# Altium project STM32F407ZXT6.PrjPcb
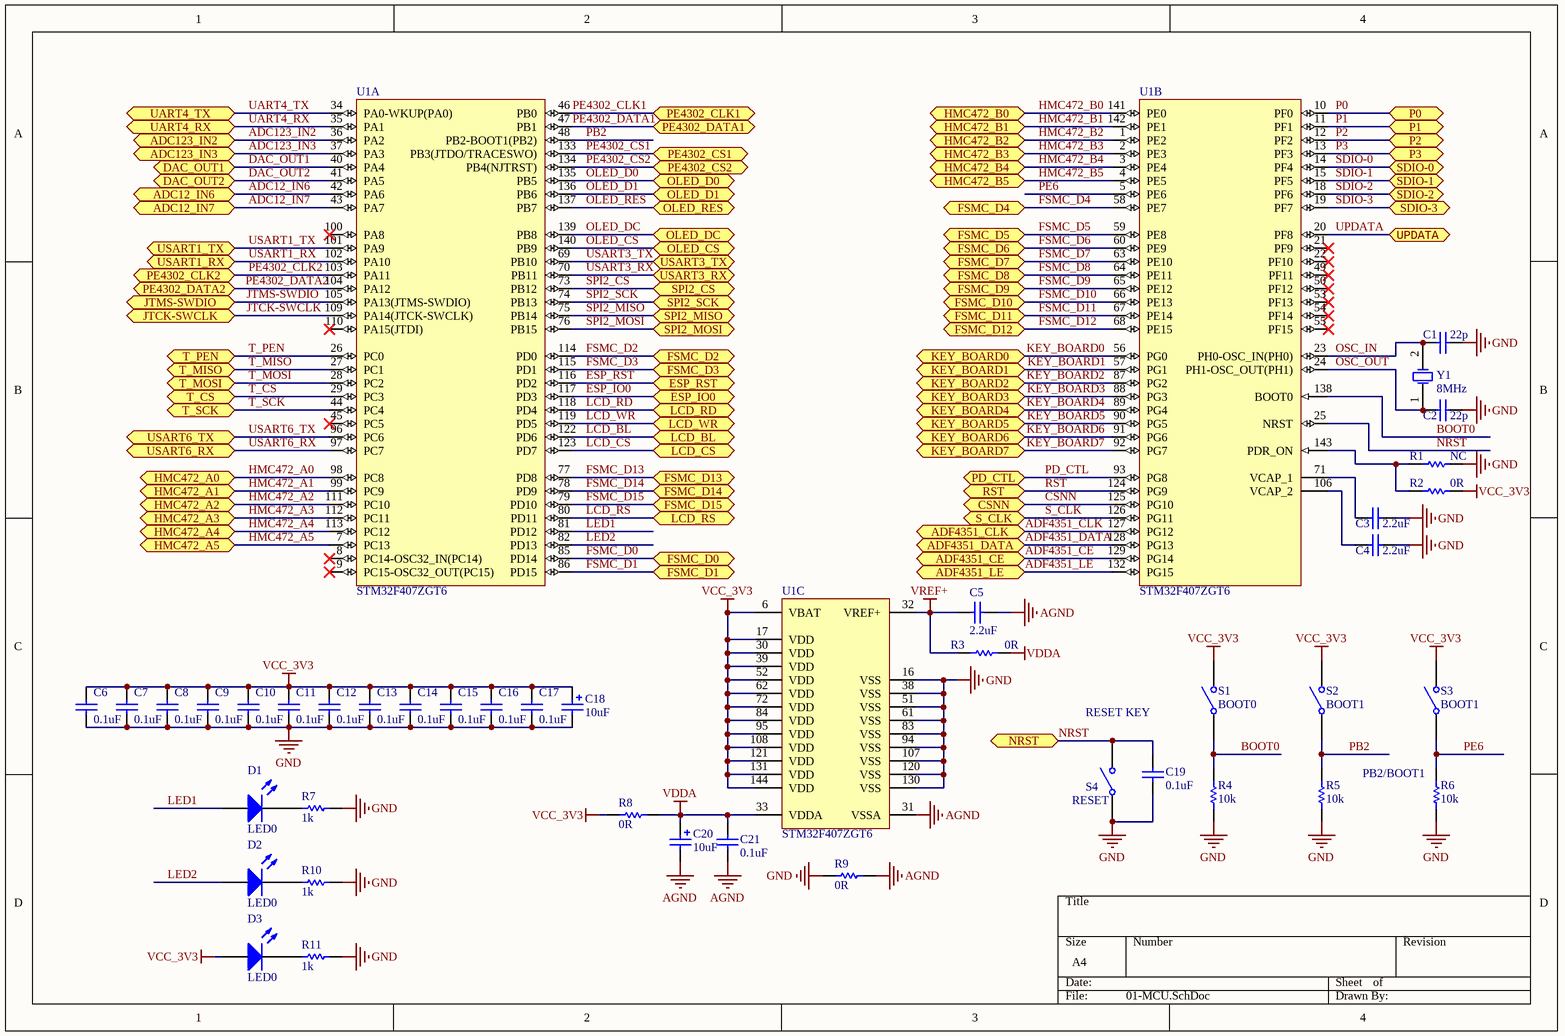
[diagram p0: 01-MCU.SchDoc]
4 sheets, 94 parts. Net scope: flat (ports and power ports of the same name join across sheets).
Board file: STM32F407ZXT6.PcbDoc
Sheets:
  01-MCU.SchDoc
  02-Interface.SchDoc
  03-Display.SchDoc
  04-POWER.SchDoc

## Sheet 01-MCU.SchDoc
size A4

### Parts
C1  22p  [0603C]
C2  22p  [0603C]
C3  2.2uF  [0603C]
C4  2.2uF  [0603C]
C5  2.2uF  [0603C]
C6  0.1uF  [0603C]
C7  0.1uF  [0603C]
C8  0.1uF  [0603C]
C9  0.1uF  [0603C]
C10  0.1uF  [0603C]
C11  0.1uF  [0603C]
C12  0.1uF  [0603C]
C13  0.1uF  [0603C]
C14  0.1uF  [0603C]
C15  0.1uF  [0603C]
C16  0.1uF  [0603C]
C17  0.1uF  [0603C]
C18  10uF  [1206T]
C19  0.1uF  [0603C]
C20  10uF  [1206T]
C21  0.1uF  [0603C]
D1  LED0  [0603D]
D2  LED0  [0603D]
D3  LED0  [0603D]
R1  NC  [0603R]
R2  0R  [0603R]
R3  0R  [0603R]
R4  10k  [0603R]
R5  10k  [0603R]
R6  10k  [0603R]
R7  1k  [0603R]
R8  0R  [0603R]
R9  0R  [0603R]
R10  1k  [0603R]
R11  1k  [0603R]
S1  BOOT0  [micro button_2_SMD]
S2  BOOT1  [micro button_2_SMD]
S3  BOOT1  [micro button_2_SMD]
S4  RESET  [micro button_2_SMD]
U1  STM32F407ZGT6  [QFP144-0r5-20X20]  (parts A,B,C of 3)
Y1  8MHz  [CO2-4R75X11R4-S]

### Ports
ADC12_IN6 (bidir), ADC12_IN7 (bidir), ADC123_IN2 (bidir), ADC123_IN3 (bidir), ADF4351_CE (bidir), ADF4351_CLK (bidir), ADF4351_DATA (bidir), ADF4351_LE (bidir), CSNN (bidir), DAC_OUT1 (bidir), DAC_OUT2 (bidir), ESP_IO0 (bidir), ESP_RST (bidir), FSMC_D0 (bidir), FSMC_D1 (bidir), FSMC_D2 (bidir), FSMC_D3 (bidir), FSMC_D4 (bidir), FSMC_D5 (bidir), FSMC_D6 (bidir), FSMC_D7 (bidir), FSMC_D8 (bidir), FSMC_D9 (bidir), FSMC_D10 (bidir), FSMC_D11 (bidir), FSMC_D12 (bidir), FSMC_D13 (bidir), FSMC_D14 (bidir), FSMC_D15 (bidir), HMC472_A0 (bidir), HMC472_A1 (bidir), HMC472_A2 (bidir), HMC472_A3 (bidir), HMC472_A4 (bidir), HMC472_A5 (bidir), HMC472_B0 (bidir), HMC472_B1 (bidir), HMC472_B2 (bidir), HMC472_B3 (bidir), HMC472_B4 (bidir), HMC472_B5 (bidir), JTCK-SWCLK (bidir), JTMS-SWDIO (bidir), KEY_BOARD0 (bidir), KEY_BOARD1 (bidir), KEY_BOARD2 (bidir), KEY_BOARD3 (bidir), KEY_BOARD4 (bidir), KEY_BOARD5 (bidir), KEY_BOARD6 (bidir), KEY_BOARD7 (bidir), LCD_BL (bidir), LCD_CS (bidir), LCD_RD (bidir), LCD_RS (bidir), LCD_WR (bidir), NRST (bidir), OLED_CS (bidir), OLED_D0 (bidir), OLED_D1 (bidir), OLED_DC (bidir), OLED_RES (bidir), P0 (bidir), P1 (bidir), P2 (bidir), P3 (bidir), PD_CTL (bidir), PE4302_CLK1 (bidir), PE4302_CLK2 (bidir), PE4302_CS1 (bidir), PE4302_CS2 (bidir), PE4302_DATA1 (bidir), PE4302_DATA2 (bidir), RST (bidir), S_CLK (bidir), SDIO-0 (bidir), SDIO-1 (bidir), SDIO-2 (bidir), SDIO-3 (bidir), SPI2_CS (bidir), SPI2_MISO (bidir), SPI2_MOSI (bidir), SPI2_SCK (bidir), T_CS (bidir), T_MISO (bidir), T_MOSI (bidir), T_PEN (bidir), T_SCK (bidir), UART4_RX (bidir), UART4_TX (bidir), UPDATA (bidir), USART1_RX (bidir), USART1_TX (bidir), USART3_RX (bidir), USART3_TX (bidir), USART6_RX (bidir), USART6_TX (bidir)

### Nets
AGND: C5.1 C20.2(-) C21.1 R9.1 U1.31(VSSA)
GND: C1.2 C2.2 C3.2 C4.2 C6.2 C7.2 C8.2 C9.2 C10.2 C11.2 C12.2 C13.2 C14.2 C15.2 C16.2 C17.2 C18.2(-) C19.1 R1.2 R4.1 R5.1 R6.1 R7.2 R9.2 R10.2 R11.2 S4.1(COMMON) U1.16(VSS) U1.38(VSS) U1.51(VSS) U1.61(VSS) U1.83(VSS) U1.94(VSS) U1.107(VSS) U1.120(VSS) U1.130(VSS)
VCC_3V3: C6.1 C7.1 C8.1 C9.1 C10.1 C11.1 C12.1 C13.1 C14.1 C15.1 C16.1 C17.1 C18.1(+) D3.1(A) R2.2 R8.2 S1.2(NO) S2.2(NO) S3.2(NO) U1.6(VBAT) U1.17(VDD) U1.30(VDD) U1.39(VDD) U1.52(VDD) U1.62(VDD) U1.72(VDD) U1.84(VDD) U1.95(VDD) U1.108(VDD) U1.121(VDD) U1.131(VDD) U1.144(VDD)
VDDA: C20.1(+) C21.2 R3.1 R8.1 U1.33(VDDA)
VREF+: C5.2 R3.2 U1.32(VREF+)
ADC12_IN6: U1.42(PA6) ; port ADC12_IN6
ADC12_IN7: U1.43(PA7) ; port ADC12_IN7
ADC123_IN2: U1.36(PA2) ; port ADC123_IN2
ADC123_IN3: U1.37(PA3) ; port ADC123_IN3
ADF4351_CE: U1.129(PG14) ; port ADF4351_CE
ADF4351_CLK: U1.127(PG12) ; port ADF4351_CLK
ADF4351_DATA: U1.128(PG13) ; port ADF4351_DATA
ADF4351_LE: U1.132(PG15) ; port ADF4351_LE
BOOT0: R4.2 S1.1(COMMON) U1.138(BOOT0)
CSNN: U1.125(PG10) ; port CSNN
DAC_OUT1: U1.40(PA4) ; port DAC_OUT1
DAC_OUT2: U1.41(PA5) ; port DAC_OUT2
ESP_IO0: U1.117(PD3) ; port ESP_IO0
ESP_RST: U1.116(PD2) ; port ESP_RST
FSMC_D0: U1.85(PD14) ; port FSMC_D0
FSMC_D1: U1.86(PD15) ; port FSMC_D1
FSMC_D2: U1.114(PD0) ; port FSMC_D2
FSMC_D3: U1.115(PD1) ; port FSMC_D3
FSMC_D4: U1.58(PE7) ; port FSMC_D4
FSMC_D5: U1.59(PE8) ; port FSMC_D5
FSMC_D6: U1.60(PE9) ; port FSMC_D6
FSMC_D7: U1.63(PE10) ; port FSMC_D7
FSMC_D8: U1.64(PE11) ; port FSMC_D8
FSMC_D9: U1.65(PE12) ; port FSMC_D9
FSMC_D10: U1.66(PE13) ; port FSMC_D10
FSMC_D11: U1.67(PE14) ; port FSMC_D11
FSMC_D12: U1.68(PE15) ; port FSMC_D12
FSMC_D13: U1.77(PD8) ; port FSMC_D13
FSMC_D14: U1.78(PD9) ; port FSMC_D14
FSMC_D15: U1.79(PD10) ; port FSMC_D15
HMC472_A0: U1.98(PC8) ; port HMC472_A0
HMC472_A1: U1.99(PC9) ; port HMC472_A1
HMC472_A2: U1.111(PC10) ; port HMC472_A2
HMC472_A3: U1.112(PC11) ; port HMC472_A3
HMC472_A4: U1.113(PC12) ; port HMC472_A4
HMC472_A5: U1.7(PC13) ; port HMC472_A5
HMC472_B0: U1.141(PE0) ; port HMC472_B0
HMC472_B1: U1.142(PE1) ; port HMC472_B1
HMC472_B2: U1.1(PE2) ; port HMC472_B2
HMC472_B3: U1.2(PE3) ; port HMC472_B3
HMC472_B4: U1.3(PE4) ; port HMC472_B4
HMC472_B5: U1.4(PE5) ; port HMC472_B5
JTCK-SWCLK: U1.109(PA14(JTCK-SWCLK)) ; port JTCK-SWCLK
JTMS-SWDIO: U1.105(PA13(JTMS-SWDIO)) ; port JTMS-SWDIO
KEY_BOARD0: U1.56(PG0) ; port KEY_BOARD0
KEY_BOARD1: U1.57(PG1) ; port KEY_BOARD1
KEY_BOARD2: U1.87(PG2) ; port KEY_BOARD2
KEY_BOARD3: U1.88(PG3) ; port KEY_BOARD3
KEY_BOARD4: U1.89(PG4) ; port KEY_BOARD4
KEY_BOARD5: U1.90(PG5) ; port KEY_BOARD5
KEY_BOARD6: U1.91(PG6) ; port KEY_BOARD6
KEY_BOARD7: U1.92(PG7) ; port KEY_BOARD7
LCD_BL: U1.122(PD6) ; port LCD_BL
LCD_CS: U1.123(PD7) ; port LCD_CS
LCD_RD: U1.118(PD4) ; port LCD_RD
LCD_RS: U1.80(PD11) ; port LCD_RS
LCD_WR: U1.119(PD5) ; port LCD_WR
LED1: D1.1(A) U1.81(PD12)
LED2: D2.1(A) U1.82(PD13)
NRST: C19.2 S4.2(NO) U1.25(NRST) ; port NRST
OLED_CS: U1.140(PB9) ; port OLED_CS
OLED_D0: U1.135(PB5) ; port OLED_D0
OLED_D1: U1.136(PB6) ; port OLED_D1
OLED_DC: U1.139(PB8) ; port OLED_DC
OLED_RES: U1.137(PB7) ; port OLED_RES
OSC_IN: C1.1 U1.23(PH0-OSC_IN(PH0)) Y1.2(OSC2)
OSC_OUT: C2.1 U1.24(PH1-OSC_OUT(PH1)) Y1.1(OSC1)
P0: U1.10(PF0) ; port P0
P1: U1.11(PF1) ; port P1
P2: U1.12(PF2) ; port P2
P3: U1.13(PF3) ; port P3
PB2: R5.2 S2.1(COMMON) U1.48(PB2-BOOT1(PB2))
PD_CTL: U1.93(PG8) ; port PD_CTL
PE6: R6.2 S3.1(COMMON) U1.5(PE6)
PE4302_CLK1: U1.46(PB0) ; port PE4302_CLK1
PE4302_CLK2: U1.103(PA11) ; port PE4302_CLK2
PE4302_CS1: U1.133(PB3(JTDO/TRACESWO)) ; port PE4302_CS1
PE4302_CS2: U1.134(PB4(NJTRST)) ; port PE4302_CS2
PE4302_DATA1: U1.47(PB1) ; port PE4302_DATA1
PE4302_DATA2: U1.104(PA12) ; port PE4302_DATA2
RST: U1.124(PG9) ; port RST
S_CLK: U1.126(PG11) ; port S_CLK
SDIO-0: U1.14(PF4) ; port SDIO-0
SDIO-1: U1.15(PF5) ; port SDIO-1
SDIO-2: U1.18(PF6) ; port SDIO-2
SDIO-3: U1.19(PF7) ; port SDIO-3
SPI2_CS: U1.73(PB12) ; port SPI2_CS
SPI2_MISO: U1.75(PB14) ; port SPI2_MISO
SPI2_MOSI: U1.76(PB15) ; port SPI2_MOSI
SPI2_SCK: U1.74(PB13) ; port SPI2_SCK
T_CS: U1.29(PC3) ; port T_CS
T_MISO: U1.27(PC1) ; port T_MISO
T_MOSI: U1.28(PC2) ; port T_MOSI
T_PEN: U1.26(PC0) ; port T_PEN
T_SCK: U1.44(PC4) ; port T_SCK
UART4_RX: U1.35(PA1) ; port UART4_RX
UART4_TX: U1.34(PA0-WKUP(PA0)) ; port UART4_TX
UPDATA: U1.20(PF8) ; port UPDATA
USART1_RX: U1.102(PA10) ; port USART1_RX
USART1_TX: U1.101(PA9) ; port USART1_TX
USART3_RX: U1.70(PB11) ; port USART3_RX
USART3_TX: U1.69(PB10) ; port USART3_TX
USART6_RX: U1.97(PC7) ; port USART6_RX
USART6_TX: U1.96(PC6) ; port USART6_TX
NetC3_1: C3.1 U1.71(VCAP_1)
NetC4_1: C4.1 U1.106(VCAP_2)
NetD1_2: D1.2(K) R7.1
NetD2_2: D2.2(K) R10.1
NetD3_2: D3.2(K) R11.1
NetR1_1: R1.1 R2.1 U1.143(PDR_ON)

Not connected (* = marked no-connect by the designer): U1 8(PC14-OSC32_IN(PC14))* 9(PC15-OSC32_OUT(PC15))* 21(PF9)* 22(PF10)* 45(PC5)* 49(PF11)* 50(PF12)* 53(PF13)* 54(PF14)* 55(PF15)* 100(PA8)* 110(PA15(JTDI))*

### Notes on the sheet
- RESET KEY
- (near R6) PB2/BOOT1

### Library data of the parts
C1-C17 C19 C21 = Cap1: CAP CER 10000PF 100V X7R 0603; Manufacturer: TDK Corporation; Manufacturer Part Number: C1608X7R2A103K080AA; Tolerance: ±10%; Notification: Current market demand for these product types have resulted in fluctuating and extending lead times. Lead times may differ.; Supplier 1: Digi-Key; RoHS: RoHS Compliant; Category: Capacitors; Stock 1: 40000; Pricing 1: 4000=0.01438 (USD); Packaging: Tape & Reel (TR); Part Status: Active; Voltage - Rated: 100V; Temperature Coefficient: X7R; Operating Temperature: -55°C ~ 125°C; Features: -; Ratings: -; Applications: General Purpose; Failure Rate: -; Mounting Type: Surface Mount, MLCC; Package / Case: 0603 (1608 Metric); Size / Dimension: 0.063" L x 0.032" W (1.60mm x 0.80mm); Height - Seated (Max): -; Thickness (Max): 0.035" (0.90mm); Lead Spacing: -; Lead Style: -; ComponentLink1URL: https://product.tdk.com/info/en/catalog/datasheets/mlcc_commercial_midvoltage_en.pdf; ComponentLink1Description: https://product.tdk.com/info/en/catalog/datasheets/mlcc_commercial_midvoltage_en.pdf; Supplier Part Number 1: 445-1304-2-ND
  C1 C2: Value: 22p
  C3-C5: Value: 2.2uF
  C6-C17 C19 C21: Value: 0.1uF
C18 C20 = Cap2: CAP TANT 10UF 10V 10% 1206; Manufacturer: KEMET; Manufacturer Part Number: T491A106K010AT7280; Manufacturer Size Code: A; Type: Molded; ESR (Equivalent Series Resistance): 3.8 Ohm; Lifetime @ Temp.: 2000 Hrs @ 125°C; Notification: Current market demand for these product types have resulted in fluctuating and extending lead times. Lead times may differ.; Supplier 1: Digi-Key; RoHS: RoHS Compliant; Category: Capacitors; Stock 1: 27000; Pricing 1: 9000=0.084, 18000=0.08138, 27000=0.07875, 63000=0.0735 (USD); Packaging: Tape & Reel (TR); Part Status: Active; Tolerance: ±10%; Operating Temperature: -55°C ~ 125°C; Mounting Type: Surface Mount; Package / Case: 1206 (3216 Metric); Size / Dimension: 0.126" L x 0.063" W (3.20mm x 1.60mm); Height - Seated (Max): 0.071" (1.80mm); Lead Spacing: -; Features: General Purpose; Failure Rate: -; ComponentLink1URL: https://api.kemet.com/component-edge/download/datasheet/T491A106K010AT7280.pdf; ComponentLink1Description: https://api.kemet.com/component-edge/download/datasheet/T491A106K010AT7280.pdf; Supplier Part Number 1: 399-8268-2-ND; Value: 10uF
D1-D3 = LED0: Typical INFRARED GaAs LED; pin to pad: 1>2 2>1; Published: 8-Jun-2000; LatestRevisionDate: 08-Jul-2005; LatestRevisionNote: Mech Layer 1 removed.; PackageReference: LED-0; Publisher: Altium Limited; PackageDescription: LED; 2 Leads
R1-R11 = Res1: RES SMD 1K OHM 0.5% 1/16W 0603; Manufacturer: Susumu; Manufacturer Part Number: RR0816P-102-D; Power (Watts): 0.063W, 1/16W; Temperature Coefficient: ±25ppm/°C; Supplier 1: Digi-Key; RoHS: RoHS Compliant; Category: Resistors; Stock 1: 1648842; Pricing 1: 1=0.13, 10=0.122, 100=0.0483, 1000=0.0225, 2500=0.01973 (USD); Packaging: Digi-Reel?; Part Status: Active; Tolerance: ±0.5%; Composition: Thin Film; Features: -; Operating Temperature: -55°C ~ 125°C; Package / Case: 0603 (1608 Metric); Supplier Device Package: -; Size / Dimension: 0.063" L x 0.032" W (1.60mm x 0.80mm); Height - Seated (Max): 0.020" (0.50mm); Failure Rate: -; ComponentLink1URL: http://www.susumu.co.jp/common/pdf/n_catalog_partition05_en.pdf; ComponentLink1Description: http://www.susumu.co.jp/common/pdf/n_catalog_partition05_en.pdf; Supplier Part Number 1: RR08P1.0KDDKR-ND
  R1: Value: NC
  R2 R3 R8 R9: Value: 0R
  R4-R6: Value: 10k
  R7 R10 R11: Value: 1k
S1-S4 = SW-SPST: Single-Pole, Single-Throw Switch; Published: 24-Mar-1999; LatestRevisionDate: 17-Jul-2002; LatestRevisionNote: Re-released for DXP Platform.; PackageReference: SPST-2; Publisher: Altium Limited; PackageDescription: Switch; 2 Leads
U1 = STM32F407ZGT6: ARM Cortex-M4 32-bit MCU+FPU, 210 DMIPS, 1024 kB Flash, 192 kB Internal RAM, 114 I/Os, 144-pin LQFP, -40 to 85 degC, Tray; Manufacturer: STMicroelectronics; D/A Converter: 2x12-bit; FLASH Size (Prog) (kB): 1024; I/Os (High Current): 114; Internal RAM Size (kB): 192; Operating Frequency(F) (Processor speed) (MHz): 168; Supply Voltage(Vcc) max (V): 3.6; Supply Voltage(Vcc) min (V): 1.8; DatasheetVersion: Rev. 4; PackageVersion: Rev. 4, 06/2013; PackageReference: LQFP144; PackageDescription: 144-Pin Low Profile Quad Flat Package, 20 x 20 mm Body, 0.5 mm Pitch; Supplier 1: Digi-Key; Supplier Part Number 1: 497-11766-ND; Supplier 2: Newark; Supplier Part Number 2: 73T2334; Supplier 3: Mouser; Supplier Part Number 3: 511-STM32F407ZGT6; Core: ARM Cortex-M4; Packing: Tray; Mounting Technology: Surface Mount; PartNumber: STM32F407ZGT6; ComponentLink1Description: Manufacturer URL; ComponentLink1URL: http://www.st.com/web/en/home.html; ComponentLink2Description: Datasheet; ComponentLink2URL: http://www.st.com/st-web-ui/static/active/en/resource/technical/document/datasheet/DM00037051.pdf; ComponentLink3Description: Package Specification; ComponentLink3URL: http://www.st.com/st-web-ui/static/active/en/resource/technical/document/datasheet/DM00037051.pdf
Y1 = XTAL: Crystal Oscillator; Published: 8-Jun-2000; LatestRevisionDate: 17-Jul-2002; LatestRevisionNote: Re-released for DXP Platform.; PackageReference: R38; Publisher: Altium Limited; PackageDescription: Crystal, Thru-Hole; 2 Leads; Body 3.1 x 8.2 mm (Dia.xH)

## Sheet 02-Interface.SchDoc
size A4
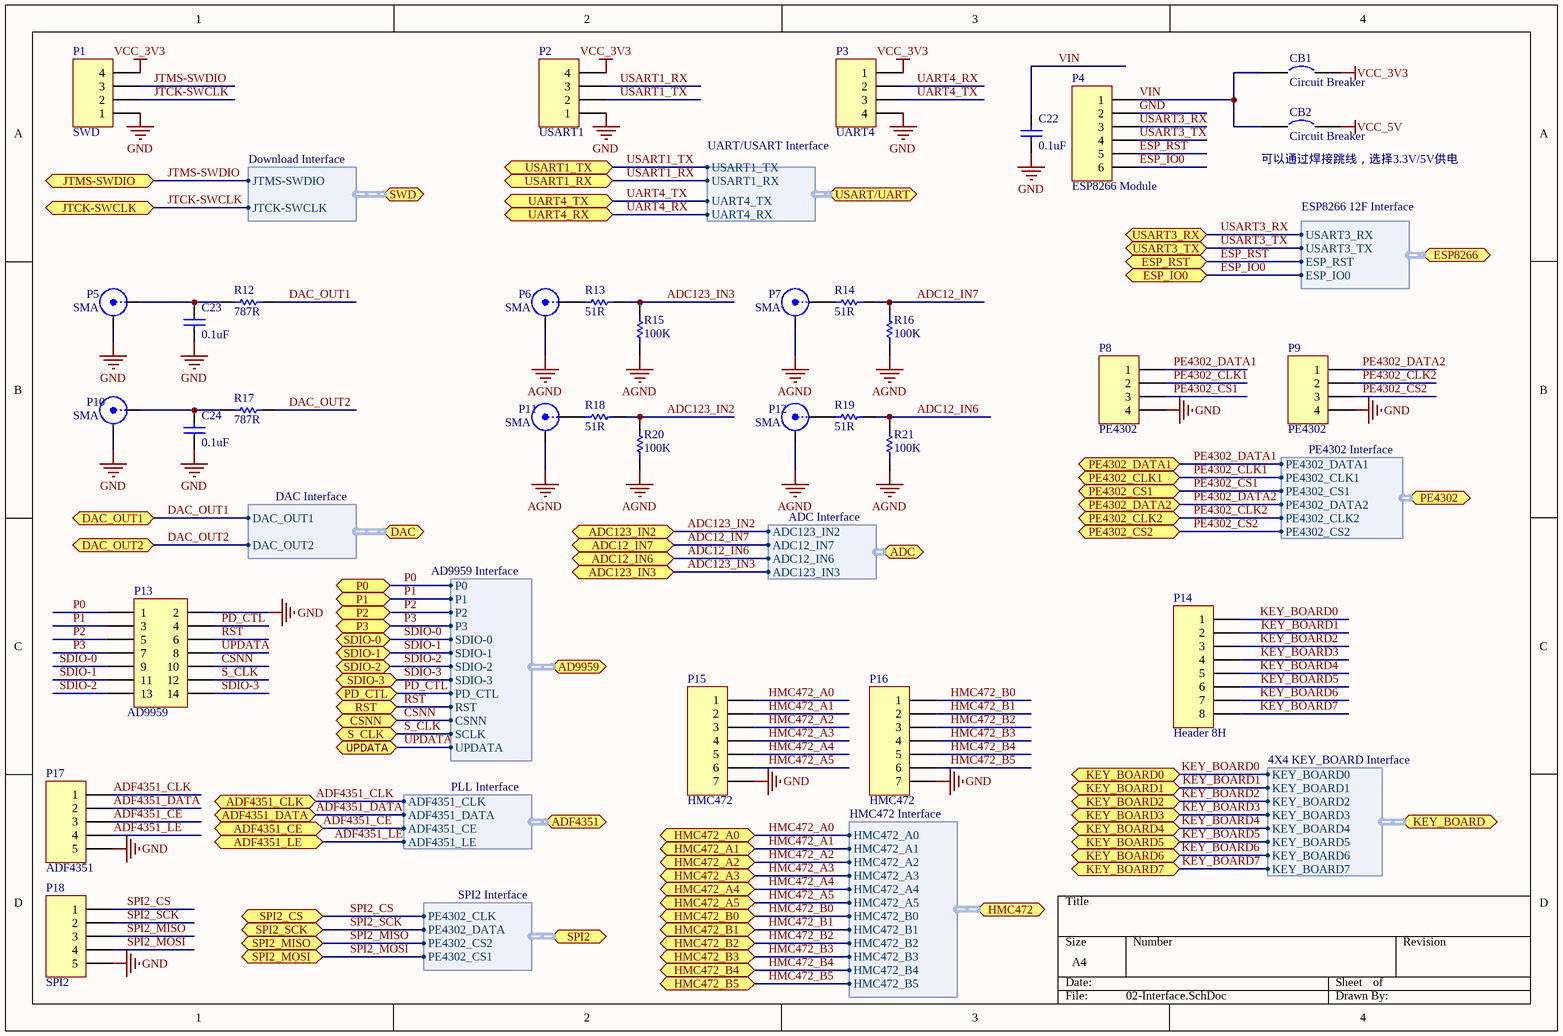
[diagram p1: 02-Interface.SchDoc]

### Parts
C22  0.1uF  [0603C]
C23  0.1uF  [0603C]
C24  0.1uF  [0603C]
CB1  Circuit Breaker  [CON20VP2R54-1X2TM]
CB2  Circuit Breaker  [CON20VP2R54-1X2TM]
P1  SWD  [1.25PWT-4P]
P2  USART1  [1.25PWT-4P]
P3  UART4  [XH_4]
P4  ESP8266 Module  [CON20VP2R54-1X6TM]
P5  SMA  [SMA-KE]
P6  SMA  [SMA-KE]
P7  SMA  [SMA-KE]
P8  PE4302  [XH_4]
P9  PE4302  [XH_4]
P10  SMA  [SMA-KE]
P11  SMA  [SMA-KE]
P12  SMA  [SMA-KE]
P13  AD9959  [CON20VP2R54-2X7TM-1]
P14  Header 8H  [XH_8]
P15  HMC472  [XH2.54-7P]
P16  HMC472  [XH2.54-7P]
P17  ADF4351  [XH_5]
P18  SPI2  [XH_5]
R12  787R  [0603R]
R13  51R  [0603R]
R14  51R  [0603R]
R15  100K  [0603R]
R16  100K  [0603R]
R17  787R  [0603R]
R18  51R  [0603R]
R19  51R  [0603R]
R20  100K  [0603R]
R21  100K  [0603R]

### Ports
AD9959 (bidir, harness AD9959 Interface), ADC12_IN6 (bidir), ADC12_IN7 (bidir), ADC123_IN2 (bidir), ADC123_IN3 (bidir), ADC (bidir, harness ADC Interface), ADF4351 (bidir, harness PLL Interface), ADF4351_CE (bidir), ADF4351_CLK (bidir), ADF4351_DATA (bidir), ADF4351_LE (bidir), CSNN (bidir), DAC (bidir, harness DAC Interface), DAC_OUT1 (bidir), DAC_OUT2 (bidir), ESP8266 (bidir, harness ESP8266 12F Interface), ESP_IO0 (bidir), ESP_RST (bidir), HMC472 (bidir, harness HMC472 Interface), HMC472_A0 (bidir), HMC472_A1 (bidir), HMC472_A2 (bidir), HMC472_A3 (bidir), HMC472_A4 (bidir), HMC472_A5 (bidir), HMC472_B0 (bidir), HMC472_B1 (bidir), HMC472_B2 (bidir), HMC472_B3 (bidir), HMC472_B4 (bidir), HMC472_B5 (bidir), JTCK-SWCLK (bidir), JTMS-SWDIO (bidir), KEY_BOARD0 (bidir), KEY_BOARD1 (bidir), KEY_BOARD2 (bidir), KEY_BOARD3 (bidir), KEY_BOARD4 (bidir), KEY_BOARD5 (bidir), KEY_BOARD6 (bidir), KEY_BOARD7 (bidir), KEY_BOARD (bidir, harness 4X4 KEY_BOARD Interface), P0 (bidir), P1 (bidir), P2 (bidir), P3 (bidir), PD_CTL (bidir), PE4302 (bidir, harness PE4302 Interface), PE4302_CLK1 (bidir), PE4302_CLK2 (bidir), PE4302_CS1 (bidir), PE4302_CS2 (bidir), PE4302_DATA1 (bidir), PE4302_DATA2 (bidir), RST (bidir), S_CLK (bidir), SDIO-0 (bidir), SDIO-1 (bidir), SDIO-2 (bidir), SDIO-3 (bidir), SPI2 (bidir, harness SPI2 Interface), SPI2_CS (bidir), SPI2_MISO (bidir), SPI2_MOSI (bidir), SPI2_SCK (bidir), SWD (bidir, harness Download Interface), UART4_RX (bidir), UART4_TX (bidir), UPDATA (bidir), USART1_RX (bidir), USART1_TX (bidir), USART3_RX (bidir), USART3_TX (bidir), USART/UART (bidir, harness UART/USART Interface)

### Harnesses
Download Interface: JTMS-SWDIO, JTCK-SWCLK
ESP8266 12F Interface: USART3_RX, USART3_TX, ESP_RST, ESP_IO0
UART/USART Interface: USART1_TX, USART1_RX, UART4_TX, UART4_RX
DAC Interface: DAC_OUT1, DAC_OUT2
SPI2 Interface: PE4302_CLK, PE4302_DATA, PE4302_CS2, PE4302_CS1
HMC472 Interface: HMC472_A0, HMC472_A1, HMC472_A2, HMC472_A3, HMC472_A4, HMC472_A5, HMC472_B0, HMC472_B1, HMC472_B2, HMC472_B3, HMC472_B4, HMC472_B5
4X4 KEY_BOARD Interface: KEY_BOARD0, KEY_BOARD1, KEY_BOARD2, KEY_BOARD3, KEY_BOARD4, KEY_BOARD5, KEY_BOARD6, KEY_BOARD7
ADC Interface: ADC123_IN2, ADC12_IN7, ADC12_IN6, ADC123_IN3
AD9959 Interface: P0, P1, P2, P3, SDIO-0, SDIO-1, SDIO-2, SDIO-3, PD_CTL, RST, CSNN, SCLK, UPDATA
PLL Interface: ADF4351_CLK, ADF4351_DATA, ADF4351_CE, ADF4351_LE
PE4302 Interface: PE4302_DATA1, PE4302_CLK1, PE4302_CS1, PE4302_DATA2, PE4302_CLK2, PE4302_CS2

### Nets
AGND: P6.2(Y) P7.2(Y) P11.2(Y) P12.2(Y) R15.2 R16.2 R20.2 R21.2
GND: C22.2 C23.2 C24.2 P1.1 P2.1 P3.4 P4.2 P5.2(Y) P8.4 P9.4 P10.2(Y) P13.2 P15.7 P16.7 P17.5 P18.5
VCC_3V3: CB1.2 P1.4 P2.4 P3.1
VCC_5V: CB2.2
ADC12_IN6: R19.1 R21.1 ; port ADC12_IN6, port ADC.ADC12_IN6
ADC12_IN7: R14.1 R16.1 ; port ADC12_IN7, port ADC.ADC12_IN7
ADC123_IN2: R18.1 R20.1 ; port ADC123_IN2, port ADC.ADC123_IN2
ADC123_IN3: R13.1 R15.1 ; port ADC123_IN3, port ADC.ADC123_IN3
ADF4351_CE: P17.3 ; port ADF4351_CE, port ADF4351.ADF4351_CE
ADF4351_CLK: P17.1 ; port ADF4351_CLK, port ADF4351.ADF4351_CLK
ADF4351_DATA: P17.2 ; port ADF4351_DATA, port ADF4351.ADF4351_DATA
ADF4351_LE: P17.4 ; port ADF4351_LE, port ADF4351.ADF4351_LE
CSNN: P13.10 ; port CSNN, port AD9959.CSNN
DAC_OUT1: R12.1 ; port DAC_OUT1, port DAC.DAC_OUT1
DAC_OUT2: R17.1 ; port DAC_OUT2, port DAC.DAC_OUT2
ESP_IO0: P4.6 ; port ESP_IO0, port ESP8266.ESP_IO0
ESP_RST: P4.5 ; port ESP_RST, port ESP8266.ESP_RST
HMC472_A0: P15.1 ; port HMC472_A0, port HMC472.HMC472_A0
HMC472_A1: P15.2 ; port HMC472_A1, port HMC472.HMC472_A1
HMC472_A2: P15.3 ; port HMC472_A2, port HMC472.HMC472_A2
HMC472_A3: P15.4 ; port HMC472_A3, port HMC472.HMC472_A3
HMC472_A4: P15.5 ; port HMC472_A4, port HMC472.HMC472_A4
HMC472_A5: P15.6 ; port HMC472_A5, port HMC472.HMC472_A5
HMC472_B0: P16.1 ; port HMC472_B0, port HMC472.HMC472_B0
HMC472_B1: P16.2 ; port HMC472_B1, port HMC472.HMC472_B1
HMC472_B2: P16.3 ; port HMC472_B2, port HMC472.HMC472_B2
HMC472_B3: P16.4 ; port HMC472_B3, port HMC472.HMC472_B3
HMC472_B4: P16.5 ; port HMC472_B4, port HMC472.HMC472_B4
HMC472_B5: P16.6 ; port HMC472_B5, port HMC472.HMC472_B5
JTCK-SWCLK: P1.2 ; port JTCK-SWCLK, port SWD.JTCK-SWCLK
JTMS-SWDIO: P1.3 ; port JTMS-SWDIO, port SWD.JTMS-SWDIO
KEY_BOARD0: P14.1 ; port KEY_BOARD0, port KEY_BOARD.KEY_BOARD0
KEY_BOARD1: P14.2 ; port KEY_BOARD1, port KEY_BOARD.KEY_BOARD1
KEY_BOARD2: P14.3 ; port KEY_BOARD2, port KEY_BOARD.KEY_BOARD2
KEY_BOARD3: P14.4 ; port KEY_BOARD3, port KEY_BOARD.KEY_BOARD3
KEY_BOARD4: P14.5 ; port KEY_BOARD4, port KEY_BOARD.KEY_BOARD4
KEY_BOARD5: P14.6 ; port KEY_BOARD5, port KEY_BOARD.KEY_BOARD5
KEY_BOARD6: P14.7 ; port KEY_BOARD6, port KEY_BOARD.KEY_BOARD6
KEY_BOARD7: P14.8 ; port KEY_BOARD7, port KEY_BOARD.KEY_BOARD7
P0: P13.1 ; port P0, port AD9959.P0
P1: P13.3 ; port P1, port AD9959.P1
P2: P13.5 ; port P2, port AD9959.P2
P3: P13.7 ; port P3, port AD9959.P3
PD_CTL: P13.4 ; port PD_CTL, port AD9959.PD_CTL
PE4302_CLK1: P8.2 ; port PE4302_CLK1, port PE4302.PE4302_CLK1
PE4302_CLK2: P9.2 ; port PE4302_CLK2, port PE4302.PE4302_CLK2
PE4302_CS1: P8.3 ; port PE4302_CS1, port PE4302.PE4302_CS1
PE4302_CS2: P9.3 ; port PE4302_CS2, port PE4302.PE4302_CS2
PE4302_DATA1: P8.1 ; port PE4302_DATA1, port PE4302.PE4302_DATA1
PE4302_DATA2: P9.1 ; port PE4302_DATA2, port PE4302.PE4302_DATA2
RST: P13.6 ; port RST, port AD9959.RST
S_CLK: P13.12 ; port S_CLK, port AD9959.SCLK
SDIO-0: P13.9 ; port SDIO-0, port AD9959.SDIO-0
SDIO-1: P13.11 ; port SDIO-1, port AD9959.SDIO-1
SDIO-2: P13.13 ; port SDIO-2, port AD9959.SDIO-2
SDIO-3: P13.14 ; port SDIO-3, port AD9959.SDIO-3
SPI2_CS: P18.1 ; port SPI2_CS, port SPI2.PE4302_CLK
SPI2_MISO: P18.3 ; port SPI2_MISO, port SPI2.PE4302_CS2
SPI2_MOSI: P18.4 ; port SPI2_MOSI, port SPI2.PE4302_CS1
SPI2_SCK: P18.2 ; port SPI2_SCK, port SPI2.PE4302_DATA
UART4_RX: P3.2 ; port UART4_RX, port USART/UART.UART4_RX
UART4_TX: P3.3 ; port UART4_TX, port USART/UART.UART4_TX
UPDATA: P13.8 ; port UPDATA, port AD9959.UPDATA
USART1_RX: P2.3 ; port USART1_RX, port USART/UART.USART1_RX
USART1_TX: P2.2 ; port USART1_TX, port USART/UART.USART1_TX
USART3_RX: P4.3 ; port USART3_RX, port ESP8266.USART3_RX
USART3_TX: P4.4 ; port USART3_TX, port ESP8266.USART3_TX
VIN: C22.1 CB1.1 CB2.1 P4.1
NetC23_1: C23.1 P5.1(X) R12.2
NetC24_1: C24.1 P10.1(X) R17.2
NetP6_1: P6.1(X) R13.2
NetP7_1: P7.1(X) R14.2
NetP11_1: P11.1(X) R18.2
NetP12_1: P12.1(X) R19.2

### Notes on the sheet
- (near CB2) 可以通过焊接跳线，选择3.3V/5V供电

### Library data of the parts
C22-C24 = Cap1: as C1 on sheet 01-MCU; Supplier 1: Digi-Key; RoHS: RoHS Compliant; Category: Capacitors; Stock 1: 40000; Pricing 1: 4000=0.01438 (USD); Packaging: Tape & Reel (TR); Part Status: Active; Voltage - Rated: 100V; Temperature Coefficient: X7R; Operating Temperature: -55°C ~ 125°C; Features: -; Ratings: -; Applications: General Purpose; Failure Rate: -; Mounting Type: Surface Mount, MLCC; Package / Case: 0603 (1608 Metric); Size / Dimension: 0.063" L x 0.032" W (1.60mm x 0.80mm); Height - Seated (Max): -; Thickness (Max): 0.035" (0.90mm); Lead Spacing: -; Lead Style: -; ComponentLink1URL: https://product.tdk.com/info/en/catalog/datasheets/mlcc_commercial_midvoltage_en.pdf; ComponentLink1Description: https://product.tdk.com/info/en/catalog/datasheets/mlcc_commercial_midvoltage_en.pdf; Supplier Part Number 1: 445-1304-2-ND; Value: 0.1uF
P1-P3 P8 P9 = Header 4: Header, 4-Pin; LatestRevisionDate: 17-Jul-2002; LatestRevisionNote: Re-released for DXP Platform.; Publisher: Altium Limited
P4 = Header 6: Header, 6-Pin; LatestRevisionDate: 17-Jul-2002; LatestRevisionNote: Re-released for DXP Platform.; Publisher: Altium Limited
P5-P7 P10-P12 = BNC: BNC Elbow Connector; LatestRevisionDate: 17-Jul-2002; LatestRevisionNote: Re-released for DXP Platform.; Publisher: Altium Limited
P13 = Header 7X2: Header, 7-Pin, Dual row; LatestRevisionDate: 17-Jul-2002; LatestRevisionNote: Re-released for DXP Platform.; Publisher: Altium Limited
P14 = Header 8H: Header, 8-Pin, Right Angle; LatestRevisionDate: 17-Jul-2002; LatestRevisionNote: Re-released for DXP Platform.; Publisher: Altium Limited
P15 P16 = Header 7: Header, 7-Pin; LatestRevisionDate: 17-Jul-2002; LatestRevisionNote: Re-released for DXP Platform.; Publisher: Altium Limited
P17 P18 = Header 5: Header, 5-Pin; LatestRevisionDate: 17-Jul-2002; LatestRevisionNote: Re-released for DXP Platform.; Publisher: Altium Limited
R12-R21 = Res1: as R1 on sheet 01-MCU; Supplier 1: Digi-Key; RoHS: RoHS Compliant; Category: Resistors; Stock 1: 1648842; Pricing 1: 1=0.13, 10=0.122, 100=0.0483, 1000=0.0225, 2500=0.01973 (USD); Packaging: Digi-Reel?; Part Status: Active; Tolerance: ±0.5%; Composition: Thin Film; Features: -; Operating Temperature: -55°C ~ 125°C; Package / Case: 0603 (1608 Metric); Supplier Device Package: -; Size / Dimension: 0.063" L x 0.032" W (1.60mm x 0.80mm); Height - Seated (Max): 0.020" (0.50mm); Failure Rate: -; ComponentLink1URL: http://www.susumu.co.jp/common/pdf/n_catalog_partition05_en.pdf; ComponentLink1Description: http://www.susumu.co.jp/common/pdf/n_catalog_partition05_en.pdf; Supplier Part Number 1: RR08P1.0KDDKR-ND
  R12 R17: Value: 787R
  R13 R14 R18 R19: Value: 51R
  R15 R16 R20 R21: Value: 100K
CB1 CB2 = Circuit Breaker: Published: 24-Mar-1999; LatestRevisionDate: 17-Jul-2002; LatestRevisionNote: Re-released for DXP Platform.; PackageReference: SPST-2; Publisher: Altium Limited; PackageDescription: Switch; 2 Leads

## Sheet 03-Display.SchDoc
size A4
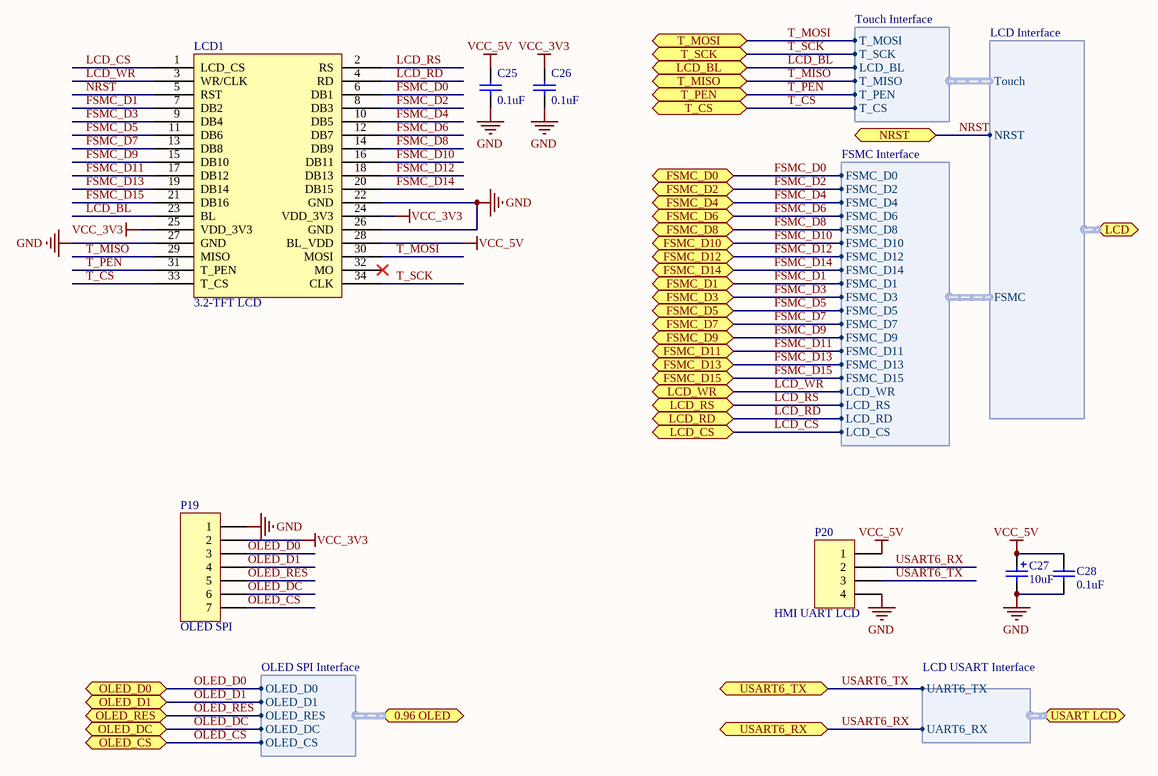
[diagram p2: 03-Display.SchDoc]

### Parts
C25  0.1uF  [0603C]
C26  0.1uF  [0603C]
C27  10uF  [1206T]
C28  0.1uF  [0603C]
LCD1  3.2-TFT LCD  [3.2_LCD]
P19  OLED SPI  [OLED_0.96_SPI]
P20  HMI UART LCD  [xh_4]

### Ports
0.96 OLED (bidir, harness OLED SPI Interface), FSMC_D0 (bidir), FSMC_D1 (bidir), FSMC_D2 (bidir), FSMC_D3 (bidir), FSMC_D4 (bidir), FSMC_D5 (bidir), FSMC_D6 (bidir), FSMC_D7 (bidir), FSMC_D8 (bidir), FSMC_D9 (bidir), FSMC_D10 (bidir), FSMC_D11 (bidir), FSMC_D12 (bidir), FSMC_D13 (bidir), FSMC_D14 (bidir), FSMC_D15 (bidir), LCD (bidir, harness LCD Interface), LCD_BL (bidir), LCD_CS (bidir), LCD_RD (bidir), LCD_RS (bidir), LCD_WR (bidir), NRST (bidir), OLED_CS (bidir), OLED_D0 (bidir), OLED_D1 (bidir), OLED_DC (bidir), OLED_RES (bidir), T_CS (bidir), T_MISO (bidir), T_MOSI (bidir), T_PEN (bidir), T_SCK (bidir), USART6_RX (bidir), USART6_TX (bidir), USART LCD (bidir, harness LCD USART Interface)

### Harnesses
LCD Interface: NRST, Touch, FSMC
Touch Interface: T_MOSI, T_SCK, LCD_BL, T_MISO, T_PEN, T_CS
FSMC Interface: FSMC_D0, FSMC_D2, FSMC_D4, FSMC_D6, FSMC_D8, FSMC_D10, FSMC_D12, FSMC_D14, FSMC_D1, FSMC_D3, FSMC_D5, FSMC_D7, FSMC_D9, FSMC_D11, FSMC_D13, FSMC_D15, LCD_WR, LCD_RS, LCD_RD, LCD_CS
OLED SPI Interface: OLED_D0, OLED_D1, OLED_RES, OLED_DC, OLED_CS
LCD USART Interface: UART6_TX, UART6_RX

### Nets
GND: C25.2 C26.2 C27.2(-) C28.1 LCD1.22(GND) LCD1.26(GND) LCD1.27(GND) P19.1 P20.4
VCC_3V3: C26.1 LCD1.24(VDD_3V3) LCD1.25(VDD_3V3) P19.2
VCC_5V: C25.1 C27.1(+) C28.2 LCD1.28(BL_VDD) P20.1
FSMC_D0: LCD1.6(DB1) ; port FSMC_D0, harness FSMC Interface.FSMC_D0
FSMC_D1: LCD1.7(DB2) ; port FSMC_D1, harness FSMC Interface.FSMC_D1
FSMC_D2: LCD1.8(DB3) ; port FSMC_D2, harness FSMC Interface.FSMC_D2
FSMC_D3: LCD1.9(DB4) ; port FSMC_D3, harness FSMC Interface.FSMC_D3
FSMC_D4: LCD1.10(DB5) ; port FSMC_D4, harness FSMC Interface.FSMC_D4
FSMC_D5: LCD1.11(DB6) ; port FSMC_D5, harness FSMC Interface.FSMC_D5
FSMC_D6: LCD1.12(DB7) ; port FSMC_D6, harness FSMC Interface.FSMC_D6
FSMC_D7: LCD1.13(DB8) ; port FSMC_D7, harness FSMC Interface.FSMC_D7
FSMC_D8: LCD1.14(DB9) ; port FSMC_D8, harness FSMC Interface.FSMC_D8
FSMC_D9: LCD1.15(DB10) ; port FSMC_D9, harness FSMC Interface.FSMC_D9
FSMC_D10: LCD1.16(DB11) ; port FSMC_D10, harness FSMC Interface.FSMC_D10
FSMC_D11: LCD1.17(DB12) ; port FSMC_D11, harness FSMC Interface.FSMC_D11
FSMC_D12: LCD1.18(DB13) ; port FSMC_D12, harness FSMC Interface.FSMC_D12
FSMC_D13: LCD1.19(DB14) ; port FSMC_D13, harness FSMC Interface.FSMC_D13
FSMC_D14: LCD1.20(DB15) ; port FSMC_D14, harness FSMC Interface.FSMC_D14
FSMC_D15: LCD1.21(DB16) ; port FSMC_D15, harness FSMC Interface.FSMC_D15
LCD_BL: LCD1.23(BL) ; port LCD_BL, harness Touch Interface.LCD_BL
LCD_CS: LCD1.1(LCD_CS) ; port LCD_CS, harness FSMC Interface.LCD_CS
LCD_RD: LCD1.4(RD) ; port LCD_RD, harness FSMC Interface.LCD_RD
LCD_RS: LCD1.2(RS) ; port LCD_RS, harness FSMC Interface.LCD_RS
LCD_WR: LCD1.3(WR/CLK) ; port LCD_WR, harness FSMC Interface.LCD_WR
NRST: LCD1.5(RST) ; port NRST, port LCD.NRST
OLED_CS: P19.7 ; port OLED_CS, port 0.96 OLED.OLED_CS
OLED_D0: P19.3 ; port OLED_D0, port 0.96 OLED.OLED_D0
OLED_D1: P19.4 ; port OLED_D1, port 0.96 OLED.OLED_D1
OLED_DC: P19.6 ; port OLED_DC, port 0.96 OLED.OLED_DC
OLED_RES: P19.5 ; port OLED_RES, port 0.96 OLED.OLED_RES
T_CS: LCD1.33(T_CS) ; port T_CS, harness Touch Interface.T_CS
T_MISO: LCD1.29(MISO) ; port T_MISO, harness Touch Interface.T_MISO
T_MOSI: LCD1.30(MOSI) ; port T_MOSI, harness Touch Interface.T_MOSI
T_PEN: LCD1.31(T_PEN) ; port T_PEN, harness Touch Interface.T_PEN
T_SCK: LCD1.34(CLK) ; port T_SCK, harness Touch Interface.T_SCK
USART6_RX: P20.2 ; port USART6_RX, port USART LCD.UART6_RX
USART6_TX: P20.3 ; port USART6_TX, port USART LCD.UART6_TX

Not connected (* = marked no-connect by the designer): LCD1 32(MO)*

### Library data of the parts
C25 C26 C28 = Cap1: as C1 on sheet 01-MCU; Supplier 1: Digi-Key; RoHS: RoHS Compliant; Category: Capacitors; Stock 1: 40000; Pricing 1: 4000=0.01438 (USD); Packaging: Tape & Reel (TR); Part Status: Active; Voltage - Rated: 100V; Temperature Coefficient: X7R; Operating Temperature: -55°C ~ 125°C; Features: -; Ratings: -; Applications: General Purpose; Failure Rate: -; Mounting Type: Surface Mount, MLCC; Package / Case: 0603 (1608 Metric); Size / Dimension: 0.063" L x 0.032" W (1.60mm x 0.80mm); Height - Seated (Max): -; Thickness (Max): 0.035" (0.90mm); Lead Spacing: -; Lead Style: -; ComponentLink1URL: https://product.tdk.com/info/en/catalog/datasheets/mlcc_commercial_midvoltage_en.pdf; ComponentLink1Description: https://product.tdk.com/info/en/catalog/datasheets/mlcc_commercial_midvoltage_en.pdf; Supplier Part Number 1: 445-1304-2-ND; Value: 0.1uF
C27 = Cap2: as C18 on sheet 01-MCU; Supplier 1: Digi-Key; RoHS: RoHS Compliant; Category: Capacitors; Stock 1: 27000; Pricing 1: 9000=0.084, 18000=0.08138, 27000=0.07875, 63000=0.0735 (USD); Packaging: Tape & Reel (TR); Part Status: Active; Tolerance: ±10%; Operating Temperature: -55°C ~ 125°C; Mounting Type: Surface Mount; Package / Case: 1206 (3216 Metric); Size / Dimension: 0.126" L x 0.063" W (3.20mm x 1.60mm); Height - Seated (Max): 0.071" (1.80mm); Lead Spacing: -; Features: General Purpose; Failure Rate: -; ComponentLink1URL: https://api.kemet.com/component-edge/download/datasheet/T491A106K010AT7280.pdf; ComponentLink1Description: https://api.kemet.com/component-edge/download/datasheet/T491A106K010AT7280.pdf; Supplier Part Number 1: 399-8268-2-ND; Value: 10uF
P19 = Header 7: Header, 7-Pin; LatestRevisionDate: 17-Jul-2002; LatestRevisionNote: Re-released for DXP Platform.; Publisher: Altium Limited
P20 = Header 4: Header, 4-Pin; LatestRevisionDate: 17-Jul-2002; LatestRevisionNote: Re-released for DXP Platform.; Publisher: Altium Limited

## Sheet 04-POWER.SchDoc
size A4
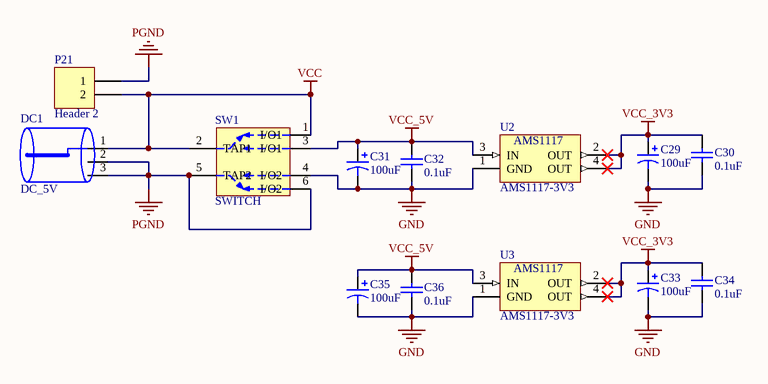
[diagram p3: 04-POWER.SchDoc]

### Parts
C29  100uF  [C_SMD(6.3x5.3)]
C30  0.1uF  [0603C]
C31  100uF  [C_SMD(6.3x5.3)]
C32  0.1uF  [0603C]
C33  100uF  [C_SMD(6.3x5.3)]
C34  0.1uF  [0603C]
C35  100uF  [C_SMD(6.3x5.3)]
C36  0.1uF  [0603C]
DC1  DC_5V  [DC_POWER]
P21  Header 2  [KF2EDG_3R81_2P]
SW1  SWITCH  [SW-8R5X8R5]
U2  AMS1117-3V3  [SOT223]
U3  AMS1117-3V3  [SOT223]

### Nets
GND: C29.2 C30.1 C31.2 C32.1 C33.2 C34.1 C35.2 C36.1 SW1.4(I/O2) U2.1(GND) U3.1(GND)
PGND: DC1.2(VCC) DC1.3(VCC) P21.1 SW1.5(TAP2) SW1.6(I/O2)
VCC: DC1.1(VCC) P21.2 SW1.1(I/O1) SW1.2(TAP1)
VCC_3V3: C29.1 C30.2 C33.1 C34.2 U2.2(OUT) U2.4(OUT) U3.2(OUT) U3.4(OUT)
VCC_5V: C31.1 C32.2 C35.1 C36.2 SW1.3(I/O1) U2.3(IN) U3.3(IN)

### Notes on the sheet
- (in symbol AMS1117-3v3) AMS1117

### Library data of the parts
C29 C31 C33 C35 = Cap Pol1: Polarized Capacitor (Radial); Published: 8-Jun-2000; LatestRevisionDate: 17-Jul-2002; LatestRevisionNote: Re-released for DXP Platform.; PackageReference: RB7.6-15; Publisher: Altium Limited; PackageDescription: Polarized Capacitor (Radial); 2 Leads; Value: 100uF
C30 C32 C34 C36 = Cap: Capacitor; Published: 8-Jun-2000; LatestRevisionDate: 17-Jul-2002; LatestRevisionNote: Re-released for DXP Platform.; PackageReference: RAD-0.3; Publisher: Altium Limited; PackageDescription: Radial Cap, Thru-Hole; 2 Leads; 0.3 in Pin Spacing; Value: 0.1uF
DC1 = DC_5V: DC005; Manufacturer: TruConnect; Manufacturer Part Number: K-DC-0052.5; Mount: Socket
P21 = Header 2: Header, 2-Pin; LatestRevisionDate: 17-Jul-2002; LatestRevisionNote: Re-released for DXP Platform.; Publisher: Altium Limited

## Nets that join several sheets
AGND: 01-MCU (5 pins), 02-Interface (8 pins)
GND: 01-MCU (36 pins), 02-Interface (16 pins), 03-Display (9 pins), 04-POWER (11 pins)
VCC_3V3: 01-MCU (32 pins), 02-Interface (CB1.2 P1.4 P2.4 P3.1), 03-Display (C26.1 LCD1.24 LCD1.25 P19.2), 04-POWER (8 pins)
VCC_5V: 02-Interface (CB2.2), 03-Display (5 pins), 04-POWER (7 pins)
ADC12_IN6: 01-MCU (U1.42), 02-Interface (R19.1 R21.1)
ADC12_IN7: 01-MCU (U1.43), 02-Interface (R14.1 R16.1)
ADC123_IN2: 01-MCU (U1.36), 02-Interface (R18.1 R20.1)
ADC123_IN3: 01-MCU (U1.37), 02-Interface (R13.1 R15.1)
ADF4351_CE: 01-MCU (U1.129), 02-Interface (P17.3)
ADF4351_CLK: 01-MCU (U1.127), 02-Interface (P17.1)
ADF4351_DATA: 01-MCU (U1.128), 02-Interface (P17.2)
ADF4351_LE: 01-MCU (U1.132), 02-Interface (P17.4)
CSNN: 01-MCU (U1.125), 02-Interface (P13.10)
DAC_OUT1: 01-MCU (U1.40), 02-Interface (R12.1)
DAC_OUT2: 01-MCU (U1.41), 02-Interface (R17.1)
ESP_IO0: 01-MCU (U1.117), 02-Interface (P4.6)
ESP_RST: 01-MCU (U1.116), 02-Interface (P4.5)
FSMC_D0: 01-MCU (U1.85), 03-Display (LCD1.6)
FSMC_D1: 01-MCU (U1.86), 03-Display (LCD1.7)
FSMC_D2: 01-MCU (U1.114), 03-Display (LCD1.8)
FSMC_D3: 01-MCU (U1.115), 03-Display (LCD1.9)
FSMC_D4: 01-MCU (U1.58), 03-Display (LCD1.10)
FSMC_D5: 01-MCU (U1.59), 03-Display (LCD1.11)
FSMC_D6: 01-MCU (U1.60), 03-Display (LCD1.12)
FSMC_D7: 01-MCU (U1.63), 03-Display (LCD1.13)
FSMC_D8: 01-MCU (U1.64), 03-Display (LCD1.14)
FSMC_D9: 01-MCU (U1.65), 03-Display (LCD1.15)
FSMC_D10: 01-MCU (U1.66), 03-Display (LCD1.16)
FSMC_D11: 01-MCU (U1.67), 03-Display (LCD1.17)
FSMC_D12: 01-MCU (U1.68), 03-Display (LCD1.18)
FSMC_D13: 01-MCU (U1.77), 03-Display (LCD1.19)
FSMC_D14: 01-MCU (U1.78), 03-Display (LCD1.20)
FSMC_D15: 01-MCU (U1.79), 03-Display (LCD1.21)
HMC472_A0: 01-MCU (U1.98), 02-Interface (P15.1)
HMC472_A1: 01-MCU (U1.99), 02-Interface (P15.2)
HMC472_A2: 01-MCU (U1.111), 02-Interface (P15.3)
HMC472_A3: 01-MCU (U1.112), 02-Interface (P15.4)
HMC472_A4: 01-MCU (U1.113), 02-Interface (P15.5)
HMC472_A5: 01-MCU (U1.7), 02-Interface (P15.6)
HMC472_B0: 01-MCU (U1.141), 02-Interface (P16.1)
HMC472_B1: 01-MCU (U1.142), 02-Interface (P16.2)
HMC472_B2: 01-MCU (U1.1), 02-Interface (P16.3)
HMC472_B3: 01-MCU (U1.2), 02-Interface (P16.4)
HMC472_B4: 01-MCU (U1.3), 02-Interface (P16.5)
HMC472_B5: 01-MCU (U1.4), 02-Interface (P16.6)
JTCK-SWCLK: 01-MCU (U1.109), 02-Interface (P1.2)
JTMS-SWDIO: 01-MCU (U1.105), 02-Interface (P1.3)
KEY_BOARD0: 01-MCU (U1.56), 02-Interface (P14.1)
KEY_BOARD1: 01-MCU (U1.57), 02-Interface (P14.2)
KEY_BOARD2: 01-MCU (U1.87), 02-Interface (P14.3)
KEY_BOARD3: 01-MCU (U1.88), 02-Interface (P14.4)
KEY_BOARD4: 01-MCU (U1.89), 02-Interface (P14.5)
KEY_BOARD5: 01-MCU (U1.90), 02-Interface (P14.6)
KEY_BOARD6: 01-MCU (U1.91), 02-Interface (P14.7)
KEY_BOARD7: 01-MCU (U1.92), 02-Interface (P14.8)
LCD_BL: 01-MCU (U1.122), 03-Display (LCD1.23)
LCD_CS: 01-MCU (U1.123), 03-Display (LCD1.1)
LCD_RD: 01-MCU (U1.118), 03-Display (LCD1.4)
LCD_RS: 01-MCU (U1.80), 03-Display (LCD1.2)
LCD_WR: 01-MCU (U1.119), 03-Display (LCD1.3)
NRST: 01-MCU (C19.2 S4.2 U1.25), 03-Display (LCD1.5)
OLED_CS: 01-MCU (U1.140), 03-Display (P19.7)
OLED_D0: 01-MCU (U1.135), 03-Display (P19.3)
OLED_D1: 01-MCU (U1.136), 03-Display (P19.4)
OLED_DC: 01-MCU (U1.139), 03-Display (P19.6)
OLED_RES: 01-MCU (U1.137), 03-Display (P19.5)
P0: 01-MCU (U1.10), 02-Interface (P13.1)
P1: 01-MCU (U1.11), 02-Interface (P13.3)
P2: 01-MCU (U1.12), 02-Interface (P13.5)
P3: 01-MCU (U1.13), 02-Interface (P13.7)
PD_CTL: 01-MCU (U1.93), 02-Interface (P13.4)
PE4302_CLK1: 01-MCU (U1.46), 02-Interface (P8.2)
PE4302_CLK2: 01-MCU (U1.103), 02-Interface (P9.2)
PE4302_CS1: 01-MCU (U1.133), 02-Interface (P8.3)
PE4302_CS2: 01-MCU (U1.134), 02-Interface (P9.3)
PE4302_DATA1: 01-MCU (U1.47), 02-Interface (P8.1)
PE4302_DATA2: 01-MCU (U1.104), 02-Interface (P9.1)
RST: 01-MCU (U1.124), 02-Interface (P13.6)
S_CLK: 01-MCU (U1.126), 02-Interface (P13.12)
SDIO-0: 01-MCU (U1.14), 02-Interface (P13.9)
SDIO-1: 01-MCU (U1.15), 02-Interface (P13.11)
SDIO-2: 01-MCU (U1.18), 02-Interface (P13.13)
SDIO-3: 01-MCU (U1.19), 02-Interface (P13.14)
SPI2_CS: 01-MCU (U1.73), 02-Interface (P18.1)
SPI2_MISO: 01-MCU (U1.75), 02-Interface (P18.3)
SPI2_MOSI: 01-MCU (U1.76), 02-Interface (P18.4)
SPI2_SCK: 01-MCU (U1.74), 02-Interface (P18.2)
T_CS: 01-MCU (U1.29), 03-Display (LCD1.33)
T_MISO: 01-MCU (U1.27), 03-Display (LCD1.29)
T_MOSI: 01-MCU (U1.28), 03-Display (LCD1.30)
T_PEN: 01-MCU (U1.26), 03-Display (LCD1.31)
T_SCK: 01-MCU (U1.44), 03-Display (LCD1.34)
UART4_RX: 01-MCU (U1.35), 02-Interface (P3.2)
UART4_TX: 01-MCU (U1.34), 02-Interface (P3.3)
UPDATA: 01-MCU (U1.20), 02-Interface (P13.8)
USART1_RX: 01-MCU (U1.102), 02-Interface (P2.3)
USART1_TX: 01-MCU (U1.101), 02-Interface (P2.2)
USART3_RX: 01-MCU (U1.70), 02-Interface (P4.3)
USART3_TX: 01-MCU (U1.69), 02-Interface (P4.4)
USART6_RX: 01-MCU (U1.97), 03-Display (P20.2)
USART6_TX: 01-MCU (U1.96), 03-Display (P20.3)